# EAGLE schematic untitled1 (EAGLE 9.1.3)
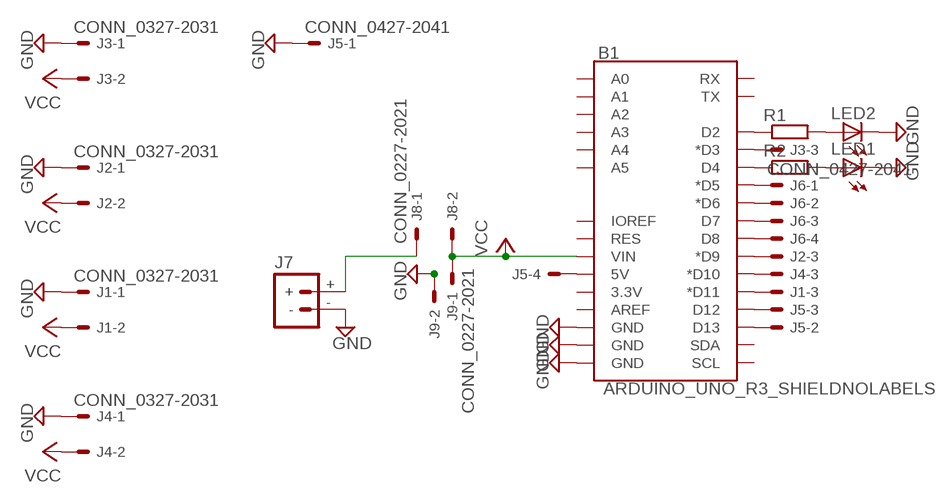
[diagram p0: schematic, sheet 1]

## Parts
B1  ARDUINO_UNO_R3_SHIELDNOLABELS  [UNO_R3_SHIELD_NOLABELS]
J1  CONN_0327-2031  [6410-03]
J2  CONN_0327-2031  [6410-03]
J3  CONN_0327-2031  [6410-03]
J4  CONN_0327-2031  [6410-03]
J5  CONN_0427-2041  [6410-04]
J6  CONN_0427-2041  [6410-04]
J7  BATTERY_CONNXT60  [XT60]
J8  CONN_0227-2021  [6410-02]
J9  CONN_0227-2021  [6410-02]
LED1  LED5MM  [LED5MM]
LED2  LED5MM  [LED5MM]
R1  R-EU_0204/7  [0204/7]
R2  R-EU_0204/7  [0204/7]

## Nets
GND: B1.GND@0(GND) B1.GND@1(GND) B1.GND@2(GND) J1.1 J2.1 J3.1 J4.1 J5.1 J7.- J9.2 LED1.K(C) LED2.K(C)
N$1: B1.D3(*D3) J3.3
N$2: B1.D9(*D9) J2.3
N$3: B1.D11(*D11) J1.3
N$4: B1.D10(*D10) J4.3
N$5: B1.D13 J5.2
N$6: B1.D12 J5.3
N$7: B1.D5(*D5) J6.1
N$8: B1.D6(*D6) J6.2
N$9: B1.D7 J6.3
N$10: B1.D8 J6.4
N$11: B1.D2 R1.1
N$12: B1.D4 R2.1
N$13: LED2.A R1.2
N$14: LED1.A R2.2
N$15: J7.+ J8.1
N$16: B1.5V J5.4
VCC: B1.VIN J1.2 J2.2 J3.2 J4.2 J8.2 J9.1
Unconnected: B1.3.3V B1.A0 B1.A1 B1.A2 B1.A3 B1.A4 B1.A5 B1.AREF B1.IOREF B1.RES B1.RX B1.SCL B1.SDA B1.TX

## Library data of the parts
B1 = Robotica-IFRN-SC-Arduino:ARDUINO_UNO_R3_SHIELD: Arduino R3 Shield Footprint Shield form compatible with the Arduino Uno R3. SparkFun Products: MG2639 Cellular Shield <https://www.sparkfun.com/products/13120> MIDI Shield <https://www.sparkfun.com/products/12898> R3 Stackable Headers Kit <https://www.sparkfun.com/products/11417>
J1-J4 = Robotica-IFRN-SC-conectores:CONN_03: CONNECTOR wire to board 2.54 mm (.1 inch) pitch header; OC_FARNELL: unknown; OC_NEWARK: unknown
J5 J6 = Robotica-IFRN-SC-conectores:CONN_04: CONNECTOR wire to board 2.54 mm (.1 inch) pitch header; OC_FARNELL: unknown; OC_NEWARK: unknown
J7 = Robotica-IFRN-SC-conectores:BATTERY_CONN: Battery Connectors Various footprints for battery connections
J8 J9 = Robotica-IFRN-SC-conectores:CONN_02: CONNECTOR wire to board 2.54 mm (.1 inch) pitch header; OC_FARNELL: unknown; OC_NEWARK: unknown
LED1 LED2 = led:LED: LED OSRAM: - CHIPLED LG R971, LG N971, LY N971, LG Q971, LY Q971, LO R971, LY R971 LH N974, LH R974 LS Q976, LO Q976, LY Q976 LO Q996 - Hyper CHIPLED LW Q18S LB Q993, LB Q99A, LB R99A - SideLED LS A670, LO A670, LY A670, LG A670, LP A670 LB A673, LV A673, LT A673, LW A673 LH A674 LY A675 LS A676, LA A676, LO A676, LY A676, LW A676 LS A679, LY A679, LG A679 - Hyper Micro SIDELED® LS Y876, LA Y876, LO Y876, LY Y876 LT Y87S - SmartLED LW L88C, LW L88S LB L89C, LB L89S, LG L890 LS L89K, LO L89K, LY L89K LS L896, LA L896, LO L896, LY L896 - TOPLED LS T670, LO T670, LY T670, LG T670, LP T670 LSG T670, LSP T670, LSY T670, LOP T670, LYG T670 LG T671, LOG T671, LSG T671 LB T673, LV T673, LT T673, LW T673 LH T674 LS T676, LA T676, LO T676, LY T676, LB T676, LH T676, LSB T676, LW T676 LB T67C, LV T67C, LT T67C, LS T67K, LO T67K, LY T67K, LW E67C LS E67B, LA E67B, LO E67B, LY E67B, LB E67C, LV E67C, LT E67C LW T67C LS T679, LY T679, LG T679 LS T770, LO T770, LY T770, LG T770, LP T770 LB T773, LV T773, LT T773, LW T773 LH T774 LS E675, LA E675, LY E675, LS T675 LS T776, LA T776, LO T776, LY T776, LB T776 LHGB T686 LT T68C, LB T68C - Hyper Mini TOPLED® LB M676 - Mini TOPLED Santana® LG M470 LS M47K, LO M47K, LY M47K Source: http://www.osram.convergy.de LUXEON: - LUMILED® LXK2-PW12-R00, LXK2-PW12-S00, LXK2-PW14-U00, LXK2-PW14-V00 LXK2-PM12-R00, LXK2-PM12-S00, LXK2-PM14-U00 LXK2-PE12-Q00, LXK2-PE12-R00, LXK2-PE12-S00, LXK2-PE14-T00, LXK2-PE14-U00 LXK2-PB12-K00, LXK2-PB12-L00, LXK2-PB12-M00, LXK2-PB14-N00, LXK2-PB14-P00, LXK2-PB14-Q00 LXK2-PR12-L00, LXK2-PR12-M00, LXK2-PR14-Q00, LXK2-PR14-R00 LXK2-PD12-Q00, LXK2-PD12-R00, LXK2-PD12-S00 LXK2-PH12-R00, LXK2-PH12-S00 LXK2-PL12-P00, LXK2-PL12-Q00, LXK2-PL12-R00 Source: www.luxeon.com KINGBRIGHT: KA-3528ASYC Source: www.kingbright.com
R1 R2 = rcl:R-EU_: RESISTOR, European symbol; SPICEPREFIX: R